# Altium project BSPD.PrjPcb
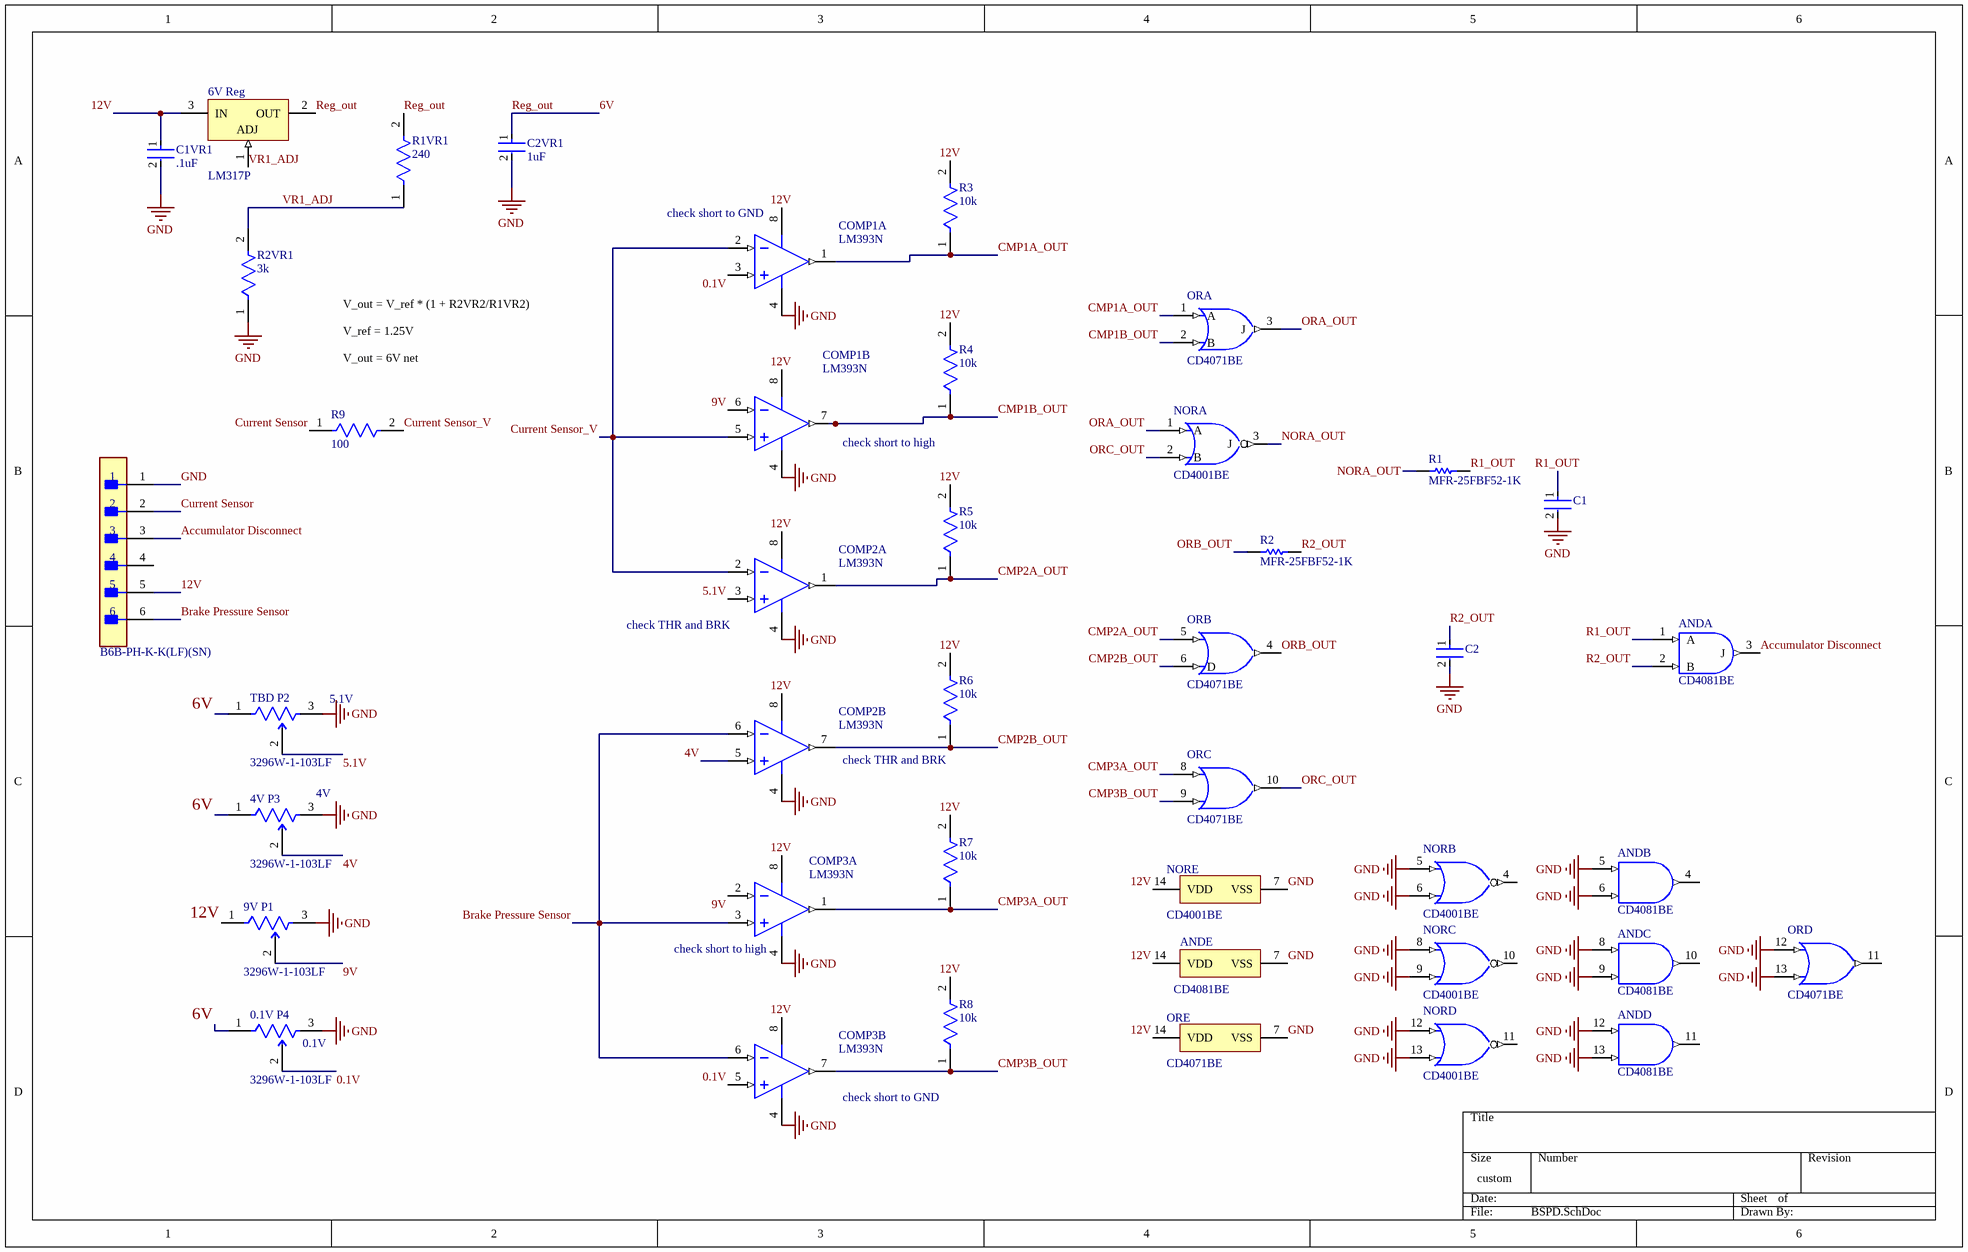
[diagram p0: BSPD.SchDoc]
1 sheet, 27 parts. Net scope: global (net labels, ports and power ports of the same name join across sheets).
Board file: BSPD.PcbDoc

## Sheet BSPD.SchDoc
size 368 x 233 mm; SheetNumber: 1; SheetTotal: 1

### Parts
0.1V_P4  3296W-1-103LF  [FP-3296W-MFG]
4V_P3  3296W-1-103LF  [FP-3296W-MFG]
6V_Reg  LM317P  [TO220FP]
9V_P1  3296W-1-103LF  [FP-3296W-MFG]
AND  CD4081BE  [N0014A]  (parts A,B,C,D,E of 5)
C1  RDER71H105K2M1H03A  [FP-RDE2M1-MFG]  (value not drawn)
C1VR1  .1uF  [FP-RDE1P1-MFG]
C2  RDER71H105K2M1H03A  [FP-RDE2M1-MFG]  (value not drawn)
C2VR1  1uF  [FP-RCE2K1-MFG]
COMP1  LM393N  [P0008A]  (parts A,B of 2)
COMP2  LM393N  [P0008A]  (parts A,B of 2)
COMP3  LM393N  [P0008A]  (parts A,B of 2)
NOR  CD4001BE  [N0014A]  (parts A,B,C,D,E of 5)
OR  CD4071BE  [N0014A]  (parts A,B,C,D,E of 5)
Plug  B6B-PH-K-K(LF)(SN)  [FP-B6B-PH-K-K_LF_SN-MFG]
R1  MFR-25FBF52-1K  [RESA60-630X240]
R1VR1  240  [FP-MRS25-MFG]
R2  MFR-25FBF52-1K  [RESA60-630X240]
R2VR1  3k  [FP-MRS25-MFG]
R3  10k  [FP-MRS25-MFG]
R4  10k  [FP-MRS25-MFG]
R5  10k  [FP-MRS25-MFG]
R6  10k  [FP-MRS25-MFG]
R7  10k  [FP-MRS25-MFG]
R8  10k  [FP-MRS25-MFG]
R9  100  [FP-MRS25-MFG]
TBD_P2  3296W-1-103LF  [FP-3296W-MFG]

### Nets
GND: 0.1V_P4.3(CW) 4V_P3.3(CW) 9V_P1.3(CW) AND.5(C) AND.6(D) AND.7(VSS) AND.8(E) AND.9(F) AND.12(G) AND.13(H) C1.2 C1VR1.2 C2.2 C2VR1.2 COMP1.4(GND) COMP2.4(GND) COMP3.4(GND) NOR.5(C) NOR.6(D) NOR.7(VSS) NOR.8(E) NOR.9(F) NOR.12(G) NOR.13(H) OR.7(VSS) OR.12(G) OR.13(H) Plug.1 R2VR1.1 TBD_P2.3(CW)
0.1V: 0.1V_P4.2(WIPER) COMP1.3(INA+) COMP3.5(INB+)
4V: 4V_P3.2(WIPER) COMP2.5(INB+)
5.1V: COMP2.3(INA+) TBD_P2.2(WIPER)
6V: 0.1V_P4.1(CCW) 4V_P3.1(CCW) 6V_Reg.2(OUT) C2VR1.1 R1VR1.2 TBD_P2.1(CCW)  [also labelled Reg_out]
9V: 9V_P1.2(WIPER) COMP1.6(INB-) COMP3.2(INA-)
12V: 6V_Reg.3(IN) 9V_P1.1(CCW) AND.14(VDD) C1VR1.1 COMP1.8(V+) COMP2.8(V+) COMP3.8(V+) NOR.14(VDD) OR.14(VDD) Plug.5 R3.2 R4.2 R5.2 R6.2 R7.2 R8.2
Accumulator Disconnect: AND.3(J) Plug.3
Brake Pressure Sensor: COMP2.6(INB-) COMP3.3(INA+) COMP3.6(INB-) Plug.6
CMP1A_OUT: COMP1.1(OUTA) OR.1(A) R3.1
CMP1B_OUT: COMP1.7(OUTB) OR.2(B) R4.1
CMP2A_OUT: COMP2.1(OUTA) OR.5(C) R5.1
CMP2B_OUT: COMP2.7(OUTB) OR.6(D) R6.1
CMP3A_OUT: COMP3.1(OUTA) OR.8(E) R7.1
CMP3B_OUT: COMP3.7(OUTB) OR.9(F) R8.1
Current Sensor: Plug.2 R9.1
Current Sensor_V: COMP1.2(INA-) COMP1.5(INB+) COMP2.2(INA-) R9.2
NORA_OUT: NOR.3(J) R1.1
ORA_OUT: NOR.1(A) OR.3(J)
ORB_OUT: OR.4(K) R2.1
ORC_OUT: NOR.2(B) OR.10(L)
R1_OUT: AND.1(A) C1.1 R1.2
R2_OUT: AND.2(B) C2.1 R2.2
VR1_ADJ: 6V_Reg.1(ADJ) R1VR1.1 R2VR1.2

Not connected (* = marked no-connect by the designer): AND 4(K) 10(L) 11(M); NOR 4(K) 10(L) 11(M); OR 11(M); Plug 4

### Notes on the sheet
- (near COMP1) check short to GND
- V_out = V_ref * (1 + R2VR2/R1VR2)
  V_ref = 1.25V
  V_out = 6V net
- check short to high
- (near COMP2) check THR and BRK
- (near TBD_P2) 5.1V
- (near 4V_P3) 4V
- check THR and BRK
- (near COMP3) check short to high
- (near 0.1V_P4) 0.1V
- check short to GND

### Library data of the parts
0.1V_P4 4V_P3 9V_P1 TBD_P2 = CMP-1747-00001-8: TRIMMER 10K OHM 0.5W PC PIN TOP; Number of Turns: 25; Tolerance: 10%; Resistance: 10kR; Max Power Dissipation: 500mW; Temperature Coefficient: 100ppm/°C; Insulation Resistance: 1GR; Min Operating Temperature: -55°C; Resistor Type: Cermet; Series: 3296; Color: Blue; Mount: Through Hole; Taper: Linear; Radiation Hardening: No; RoHS Compliant: Yes; Width: 9.53mm; Resistance Tolerance: 10%; Contact Plating: Tin; Military Standard: Not; Package Quantity: 50; Weight: 0.03oz; Lead Free: Lead Free; Power Rating: 500mW; Termination: Pin; Technology: CERMET; Max Operating Temperature: 125°C; Packaging: Rail/Tube; Length: 9.53mm; Depth: 4.83mm; Height: 11.55mm; Reach SVHC Compliant: Yes
6V_Reg = CMP-0244-00425-1: 1.5A, 1.2V to 37V Adjustable Voltage Regulator, 3-Pin TO-220FP; PackageVersion: 2011; PackageReference: TO220FP; ComponentLink2Description: Datasheet; ComponentLink1Description: Manufacturer URL; ComponentLink1URL: http://www.st.com; PackageDescription: TO, Thru-Hole, Vertical, Heatsink Mounted; 3 In-Line Leads; Pitch 2.54 mm; ComponentLink2URL: http://www.st.com/internet/com/TECHNICAL_RESOURCES/TECHNICAL_LITERATURE/DATASHEET/CD00000455.pdf; DatasheetVersion: 1/11/2011
AND = CMP-0777-00273-3: CMOS Quad 2-Input AND Gate, N0014A, TUBE; Manufacturer: Texas Instruments; F @ Nom Voltage(Max)(Mhz): 8; Bits(#): 4; VCC(Min)(V): 3; tpd @ Nom Voltage(Max)(ns): 12; VCC(Max)(V): 18; Output Drive (IOL/IOH)(Max)(mA): -6.8/6.8; Rating: Military; Voltage(Nom)(V): 10; Schmitt Trigger: No; ICC @ Nom Voltage(Max)(mA): 0.015; Technology Family: CD4000; DatasheetVersion: SCHS057C; Operating Temperature Range(C): -55 to 125; PackageReference: N0014A; Output Type: CMOS; Generic Part Number: CD4081B; Input Type: CMOS
C1 C2 = CMP-06035-045612-1: Ceramic Capacitor 1uF ±10% 50V X7R Radial; Lead Diameter: 0.5mm; Lead/Base Style: Kinked; Height - Seated (Max): 0.236inch; Tolerance: 10%; Height: 4mm; Package Quantity: 2000; Termination: Radial; Voltage Rating: 50V; Width: 4mm; Voltage Rating (DC): 50V; Lead Free: Lead Free; Case/Package: Radial; Length: 0.217inch; Mount: Through Hole; Dielectric: X7R; Packaging: Tape and Reel; Min Operating Temperature: -55°C; Max Operating Temperature: 125°C; Lead Pitch: 0.197inch; Capacitance: 1uF; Resistor Type: Ceramic
C1VR1 = CMP-06035-033965-1: Ceramic Capacitor 100nF ±10% 100V X7R Radial; Lead/Base Style: Formed Leads; Lead Diameter: 0.5mm; Voltage Rating (DC): 100V; Case/Package: Radial; Capacitance: 100nF; Lead Pitch: 0.098inch; Resistor Type: Ceramic; Tolerance: 10%; Max Operating Temperature: 125°C; Dielectric: X7R; Height - Seated (Max): 0.197inch; Voltage Rating: 100V; Lead Free: Lead Free; Height: 3.5mm; Length: 0.177inch; Packaging: Tape and Reel; Package Quantity: 1; Width: 0.124inch; Mount: Through Hole; Termination: Radial; Min Operating Temperature: -55°C
C2VR1 = CMP-06035-007361-1: Cap Ceramic Monolithic 1uF 100V 10% Thru-Hole Bulk; Lead Diameter: 0.5mm; Lead/Base Style: Formed Leads; Dielectric: X7R; Voltage Rating (DC): 100V; Tolerance: 10%; Width: 0.124inch; Termination: Radial; Length: 0.217inch; Height: 4mm; Ratings: AEC-Q200; Package Quantity: 2000; Mount: Through Hole; Height - Seated (Max): 0.157inch; Case/Package: Radial; Resistor Type: Ceramic; Lead Pitch: 0.197inch; Lead Free: Lead Free; Packaging: Tape and Reel; Voltage Rating: 100V; Min Operating Temperature: -55°C; Max Operating Temperature: 125°C; Capacitance: 1uF
COMP1-COMP3 = CMP-0055-00119-3: Low Power Low Offset Voltage Dual Comparator, 8-pin MDIP; Manufacturer: Texas Instruments; PackageTopMarking: NSUZXYTTE#*LM*393N; CompType: Amplifiers; PowerWise: N; Code_JEDEC: MS-001-BA; ComponentLink1URL: http://www.ti.com/general/docs/lit/getliterature.tsp?genericPartNumber=LM393-N&fileType=pdf; ComponentLink1Description: Datasheet URL; PackageDescription: MDIP, .365 x .250 x .130in, 8 Lead, .100in Pitch; RoHS: N; PinCount: 8; Package Reference: P0008A
NOR = CMP-0806-00193-3: CMOS Quad 2-Input NOR Gate, N0014A, TUBE; Manufacturer: Texas Instruments; VCC(Max)(V): 18; Rating: Military; Bits(#): 4; VCC(Min)(V): 3; tpd @ Nom Voltage(Max)(ns): 120; F @ Nom Voltage(Max)(Mhz): 8; ICC @ Nom Voltage(Max)(mA): 0.015; Output Drive (IOL/IOH)(Max)(mA): 1.5/-1.5; Voltage(Nom)(V): 10; Input Type: CMOS; Code_JEDEC: MS-001; DatasheetVersion: SCHS015C; Output Type: CMOS; Generic Part Number: CD4001B; PackageVersion: http://www.ti.com/lit/ml/mpdi002c/mpdi002c.pdf; PackageReference: N0014A; Operating Temperature Range(C): -55 to 125
OR = CMP-1573-00144-3: CMOS Quad 2-Input OR Gate, N0014A, TUBE; Manufacturer: Texas Instruments; Voltage(Nom)(V): 10; F @ Nom Voltage(Max)(Mhz): 8; ICC @ Nom Voltage(Max)(mA): 0.015; Rating: Military; Bits(#): 4; VCC(Min)(V): 3; tpd @ Nom Voltage(Max)(ns): 120; VCC(Max)(V): 18; Output Drive (IOL/IOH)(Max)(mA): 1.5/-1.5; PackageReference: N0014A; Code_JEDEC: MS-001; PackageVersion: http://www.ti.com/lit/ml/mpdi002c/mpdi002c.pdf; DatasheetVersion: SCHS056D; Output Type: CMOS; Generic Part Number: CD4071B; Input Type: CMOS; Operating Temperature Range(C): -55 to 125
Plug = CMP-17439-000495-1: PH Series 6 Position 2 mm Pitch Through Hole Top Entry Shrouded Header; Lead Free: Lead Free
R1 R2 = CMP-1659-00075-1: Axial Resistor, 1 KOhm, +/- 1%, 250 mW, -55 to 155 degC, 2-Pin THD, RoHS, Bulk; Voltage Rating: 250 V; Resistance: 10 kohm; Power Rating: 250 mW; ComponentLink2Description: Datasheet; RoHSCompliant: true; PackageReference: MFR-25; Case\Package: Axial; Max Operating Temperature: 155 degC; DatasheetVersion: Apr-13; Tolerance: 1%; ComponentLink1URL: http://www.yageo.com/; Length: 0.248 inch; ComponentLink2URL: http://www.yageo.com/documents/recent/Yageo%20LR_MFR_2013.pdf; Packaging: Bulk; Package Quantity: 200; PackageDescription: 2-Pin Axial Lead, Dia 2.4 mm, Body Length 6.3 mm; Min Operating Temperature: -55 degC; ComponentLink1Description: Manufacturer URL
R1VR1 R2VR1 R3-R9 = CMP-00030-42757237-1: MRS25000C1000FRP00 Resistor, 100 Ohm, ± 1%, 600 mW, Axial Leaded, Metal Film (Thin Film), Professional; Max Power Dissipation: 600mW; Resistance: 100Ω; Voltage Rating: 350V; Temperature Coefficient: 50ppm/°C; Lead Diameter: 600µm; RoHS: Compliant; Radiation Hardening: No; Schedule B: 8533210090, 8533210090; Length: 6.5mm; Packaging: Tape & Reel (TR); Number of Terminations: 2; Mount: Through Hole; Width: 2.5mm; Tolerance: 1%; Military Standard: Not; Voltage Rating (DC): 350V; Contact Plating: Tin; Number of Pins: 2; Max Operating Temperature: 155°C; NexarPartId: 42757237; Diameter: 2.5mm; Composition: Metal Film, Thin Film; REACH SVHC: Unknown; Power Rating: 600mW; Lead Free: Lead Free; Termination: Axial; Case/Package: Axial; Min Operating Temperature: -55°C